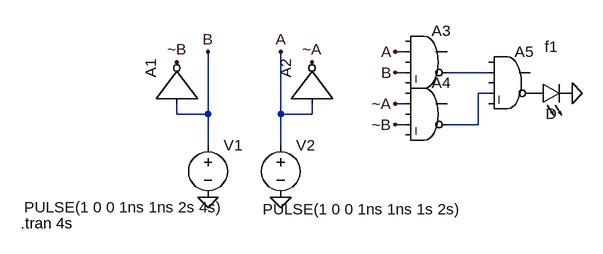
[diagram p0: schematic Parte3a.asc]
Parte3a.asc, the LTspice schematic file:
Version 4
SHEET 1 880 680
WIRE 240 16 224 16
WIRE 240 48 224 48
WIRE 368 48 304 48
WIRE 368 80 352 80
WIRE 240 96 224 96
WIRE -112 112 -112 96
WIRE -64 112 -64 16
WIRE -64 112 -112 112
WIRE 48 112 48 16
WIRE 96 112 96 96
WIRE 96 112 48 112
WIRE 240 128 224 128
WIRE 352 128 352 80
WIRE 352 128 304 128
WIRE -64 160 -64 112
WIRE 48 160 48 112
FLAG 48 16 A
FLAG -64 16 B
FLAG -112 32 ~B
FLAG 96 32 ~A
FLAG 496 80 0
FLAG 224 16 A
FLAG 224 96 ~A
FLAG 224 48 B
FLAG 224 128 ~B
FLAG 48 240 0
FLAG -64 240 0
SYMBOL voltage -64 144 R0
WINDOW 3 -283 111 Left 2
WINDOW 123 0 0 Left 0
WINDOW 39 0 0 Left 0
SYMATTR Value PULSE(1 0 0 1ns 1ns 2s 4s)
SYMATTR InstName V1
SYMBOL voltage 48 144 R0
WINDOW 3 -28 114 Left 2
WINDOW 123 0 0 Left 0
WINDOW 39 0 0 Left 0
SYMATTR Value PULSE(1 0 0 1ns 1ns 1s 2s)
SYMATTR InstName V2
SYMBOL Digital\\inv -176 96 R270
SYMATTR InstName A1
SYMBOL Digital\\inv 32 96 R270
SYMATTR InstName A2
SYMBOL Digital\\and 272 -32 R0
SYMATTR InstName A3
SYMBOL Digital\\and 272 48 R0
SYMATTR InstName A4
SYMBOL Digital\\and 400 0 R0
SYMATTR InstName A5
SYMBOL LED 432 96 R270
WINDOW 0 72 32 VTop 2
WINDOW 3 0 32 VBottom 2
SYMATTR InstName f1
TEXT -352 280 Left 2 !.tran 4s

The netlist it stands for:
* Parte3a.asc
V1 B 0 PULSE(1 0 0 1ns 1ns 2s 4s)
V2 A 0 PULSE(1 0 0 1ns 1ns 1s 2s)
A1 B 0 0 0 0 ~B 0 0 BUF
A2 A 0 0 0 0 ~A 0 0 BUF
A3 0 A 0 B 0 N001 0 0 AND
A4 0 ~A 0 ~B 0 N002 0 0 AND
A5 0 N001 0 N002 0 P001 0 0 AND
D§f1 P001 0 D
.model D D
.lib standard.dio
.tran 4s
.backanno
.end

* Results of the author's LTspice run, read from the files saved beside the schematic
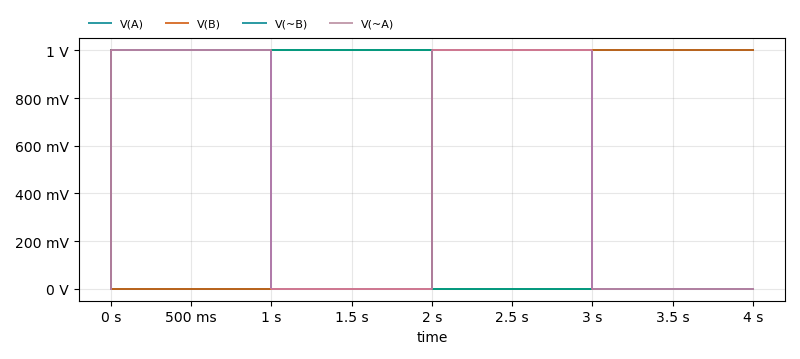
[diagram p1: Transient Analysis of Parte3a.asc, plotted from the saved traces]
* Transient Analysis, 1 run:
*   V(A): min 0 V, max 1 V, average 500 mV, rms 707.1 mV, last 1 V
*   V(B): min 0 V, max 1 V, average 500 mV, rms 707.1 mV, last 1 V
*   V(~B): min 0 V, max 1 V, average 500 mV, rms 707.1 mV, last 0 V
*   V(~A): min 0 V, max 1 V, average 500 mV, rms 707.1 mV, last 0 V